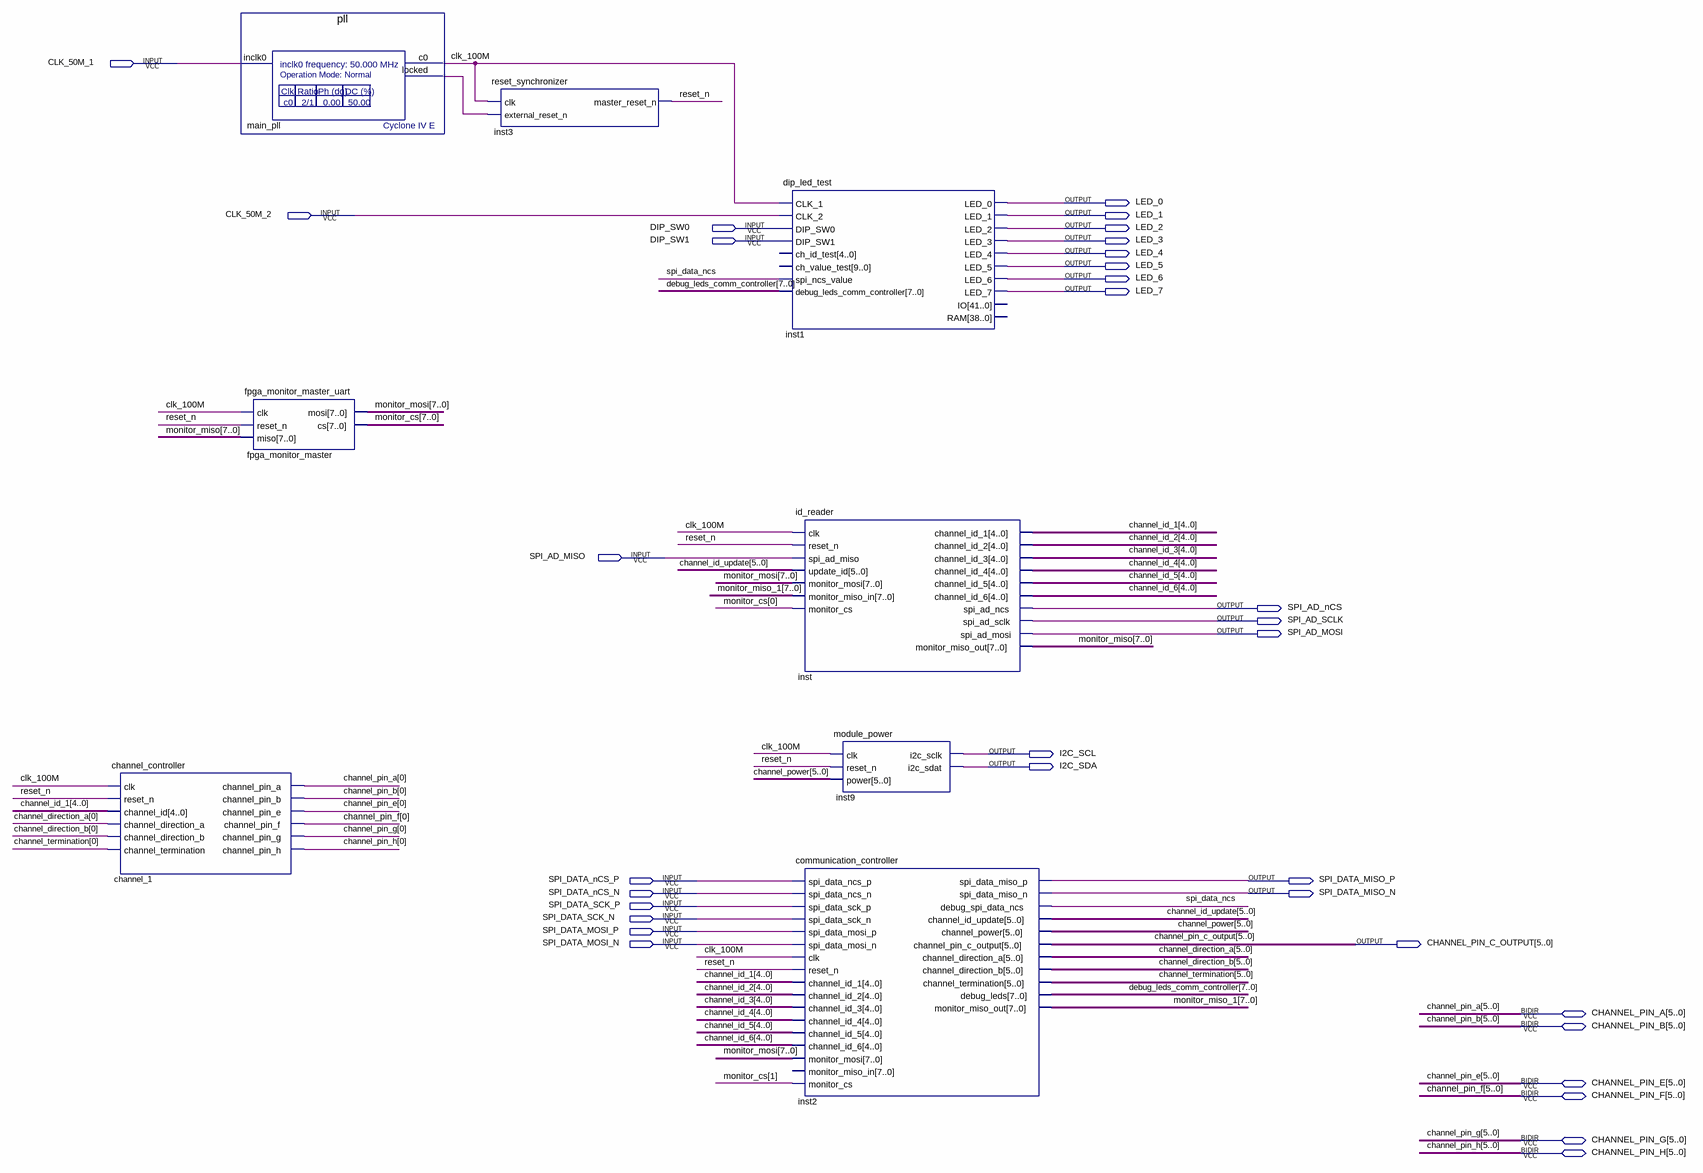
[diagram p0: schematic sheet]
// Quartus schematic data-processor-fpga.bdf as structural Verilog: 8 symbols, 33 pins
module \data-processor-fpga  (
  input  CLK_50M_1,
  input  CLK_50M_2,
  input  DIP_SW0,
  input  DIP_SW1,
  input  SPI_AD_MISO,
  input  SPI_DATA_nCS_P,
  input  SPI_DATA_nCS_N,
  input  SPI_DATA_SCK_P,
  input  SPI_DATA_SCK_N,
  input  SPI_DATA_MOSI_P,
  input  SPI_DATA_MOSI_N,
  inout  [5:0] CHANNEL_PIN_A,
  inout  [5:0] CHANNEL_PIN_B,
  inout  [5:0] CHANNEL_PIN_E,
  inout  [5:0] CHANNEL_PIN_F,
  inout  [5:0] CHANNEL_PIN_G,
  inout  [5:0] CHANNEL_PIN_H,
  output LED_0,
  output LED_1,
  output LED_2,
  output LED_3,
  output LED_4,
  output LED_5,
  output LED_6,
  output LED_7,
  output SPI_AD_nCS,
  output SPI_AD_SCLK,
  output SPI_AD_MOSI,
  output I2C_SCL,
  output I2C_SDA,
  output SPI_DATA_MISO_P,
  output SPI_DATA_MISO_N,
  output [5:0] CHANNEL_PIN_C_OUTPUT
);

  wire clk_100M, main_pll_locked, reset_n, spi_data_ncs;
  wire [4:0] channel_id_1, channel_id_2, channel_id_3, channel_id_4, channel_id_5, channel_id_6;
  wire [5:0] channel_direction_a, channel_direction_b, channel_id_update, channel_power, channel_termination;
  wire [7:0] debug_leds_comm_controller, monitor_cs, monitor_miso, monitor_miso_1, monitor_mosi;

  channel_controller channel_1 (
    .clk(clk_100M), .reset_n(reset_n), .channel_id(channel_id_1),
    .channel_direction_a(channel_direction_a[0]), .channel_direction_b(channel_direction_b[0]),
    .channel_termination(channel_termination[0]), .channel_pin_a(CHANNEL_PIN_A[0]),
    .channel_pin_b(CHANNEL_PIN_B[0]), .channel_pin_e(CHANNEL_PIN_E[0]), .channel_pin_f(CHANNEL_PIN_F[0]),
    .channel_pin_g(CHANNEL_PIN_G[0]), .channel_pin_h(CHANNEL_PIN_H[0]));
  pll main_pll (.inclk0(CLK_50M_1), .c0(clk_100M), .locked(main_pll_locked));
  fpga_monitor_master_uart fpga_monitor_master (
    .clk(clk_100M), .reset_n(reset_n), .miso(monitor_miso), .mosi(monitor_mosi), .cs(monitor_cs));
  reset_synchronizer inst3 (.clk(clk_100M), .external_reset_n(main_pll_locked), .master_reset_n(reset_n));
  dip_led_test inst1 (
    .CLK_1(clk_100M), .CLK_2(CLK_50M_2), .DIP_SW0(DIP_SW0), .DIP_SW1(DIP_SW1), .spi_ncs_value(spi_data_ncs),
    .debug_leds_comm_controller(debug_leds_comm_controller), .LED_0(LED_0), .LED_1(LED_1), .LED_2(LED_2),
    .LED_3(LED_3), .LED_4(LED_4), .LED_5(LED_5), .LED_6(LED_6), .LED_7(LED_7));  // open: ch_id_test, ch_value_test, IO, RAM
  id_reader inst (
    .clk(clk_100M), .reset_n(reset_n), .spi_ad_miso(SPI_AD_MISO), .update_id(channel_id_update),
    .monitor_mosi(monitor_mosi), .monitor_miso_in(monitor_miso_1), .monitor_cs(monitor_cs[0]),
    .channel_id_1(channel_id_1), .channel_id_2(channel_id_2), .channel_id_3(channel_id_3),
    .channel_id_4(channel_id_4), .channel_id_5(channel_id_5), .channel_id_6(channel_id_6),
    .spi_ad_ncs(SPI_AD_nCS), .spi_ad_sclk(SPI_AD_SCLK), .spi_ad_mosi(SPI_AD_MOSI),
    .monitor_miso_out(monitor_miso));
  communication_controller inst2 (
    .spi_data_ncs_p(SPI_DATA_nCS_P), .spi_data_ncs_n(SPI_DATA_nCS_N), .spi_data_sck_p(SPI_DATA_SCK_P),
    .spi_data_sck_n(SPI_DATA_SCK_N), .spi_data_mosi_p(SPI_DATA_MOSI_P), .spi_data_mosi_n(SPI_DATA_MOSI_N),
    .clk(clk_100M), .reset_n(reset_n), .channel_id_1(channel_id_1), .channel_id_2(channel_id_2),
    .channel_id_3(channel_id_3), .channel_id_4(channel_id_4), .channel_id_5(channel_id_5),
    .channel_id_6(channel_id_6), .monitor_mosi(monitor_mosi), .monitor_cs(monitor_cs[1]),
    .spi_data_miso_p(SPI_DATA_MISO_P), .spi_data_miso_n(SPI_DATA_MISO_N), .debug_spi_data_ncs(spi_data_ncs),
    .channel_id_update(channel_id_update), .channel_power(channel_power),
    .channel_pin_c_output(CHANNEL_PIN_C_OUTPUT), .channel_direction_a(channel_direction_a),
    .channel_direction_b(channel_direction_b), .channel_termination(channel_termination),
    .debug_leds(debug_leds_comm_controller), .monitor_miso_out(monitor_miso_1));  // open: monitor_miso_in
  module_power inst9 (.clk(clk_100M), .reset_n(reset_n), .power(channel_power), .i2c_sclk(I2C_SCL), .i2c_sdat(I2C_SDA));
endmodule
